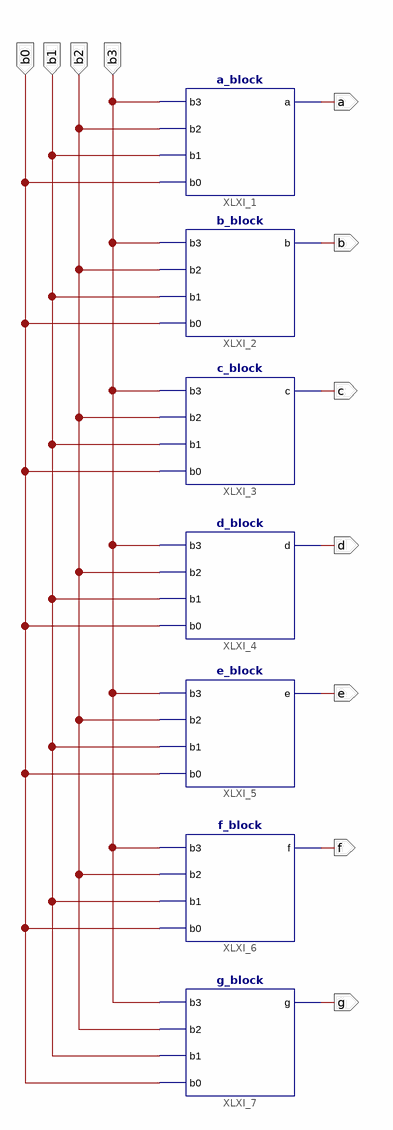
[diagram p0: schematic sheet 1]
// Xilinx ISE schematic bcdto7segment.sch (xc9500xl) as structural Verilog: 7 symbols, 11 ports
module bcdto7segment (
  input  b3,
  input  b2,
  input  b1,
  input  b0,
  output a,
  output b,
  output c,
  output d,
  output e,
  output f,
  output g
);

  a_block XLXI_1 (.a(a), .b0(b0), .b1(b1), .b2(b2), .b3(b3));
  b_block XLXI_2 (.b(b), .b0(b0), .b1(b1), .b2(b2), .b3(b3));
  c_block XLXI_3 (.b0(b0), .b1(b1), .b2(b2), .b3(b3), .c(c));
  d_block XLXI_4 (.b0(b0), .b1(b1), .b2(b2), .b3(b3), .d(d));
  e_block XLXI_5 (.b0(b0), .b1(b1), .b2(b2), .b3(b3), .e(e));
  f_block XLXI_6 (.b0(b0), .b1(b1), .b2(b2), .b3(b3), .f(f));
  g_block XLXI_7 (.b0(b0), .b1(b1), .b2(b2), .b3(b3), .g(g));
endmodule
